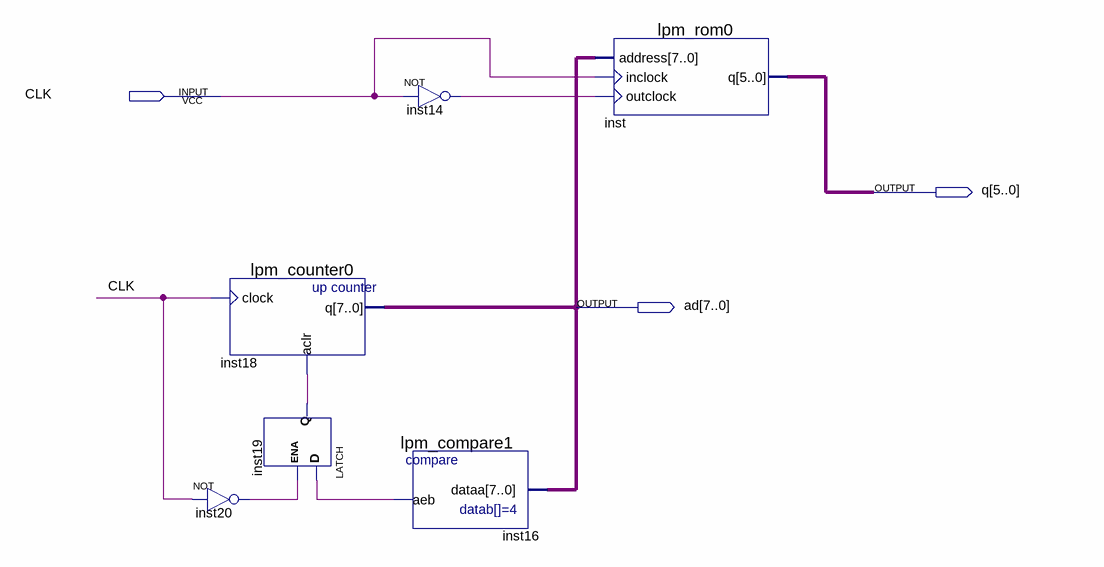
[diagram p0: schematic sheet]
// Quartus schematic trom.bdf as structural Verilog: 6 symbols, 3 pins
module trom (
  input  CLK,
  output [5:0] q,
  output [7:0] ad
);

  wire inst14_out, inst16_aeb, inst19_q, inst20_out;

  not inst20 (inst20_out, CLK);
  lpm_counter0 inst18 (.clock(CLK), .aclr(inst19_q), .q(ad));
  LATCH inst19 (.D(inst16_aeb), .ENA(inst20_out), .Q(inst19_q));
  not inst14 (inst14_out, CLK);
  lpm_compare1 inst16 (.dataa(ad), .aeb(inst16_aeb));
  lpm_rom0 inst (.address(ad), .inclock(CLK), .outclock(inst14_out), .q(q));
endmodule
